# Altium schematic sheet AMX30.SchDoc
size A3
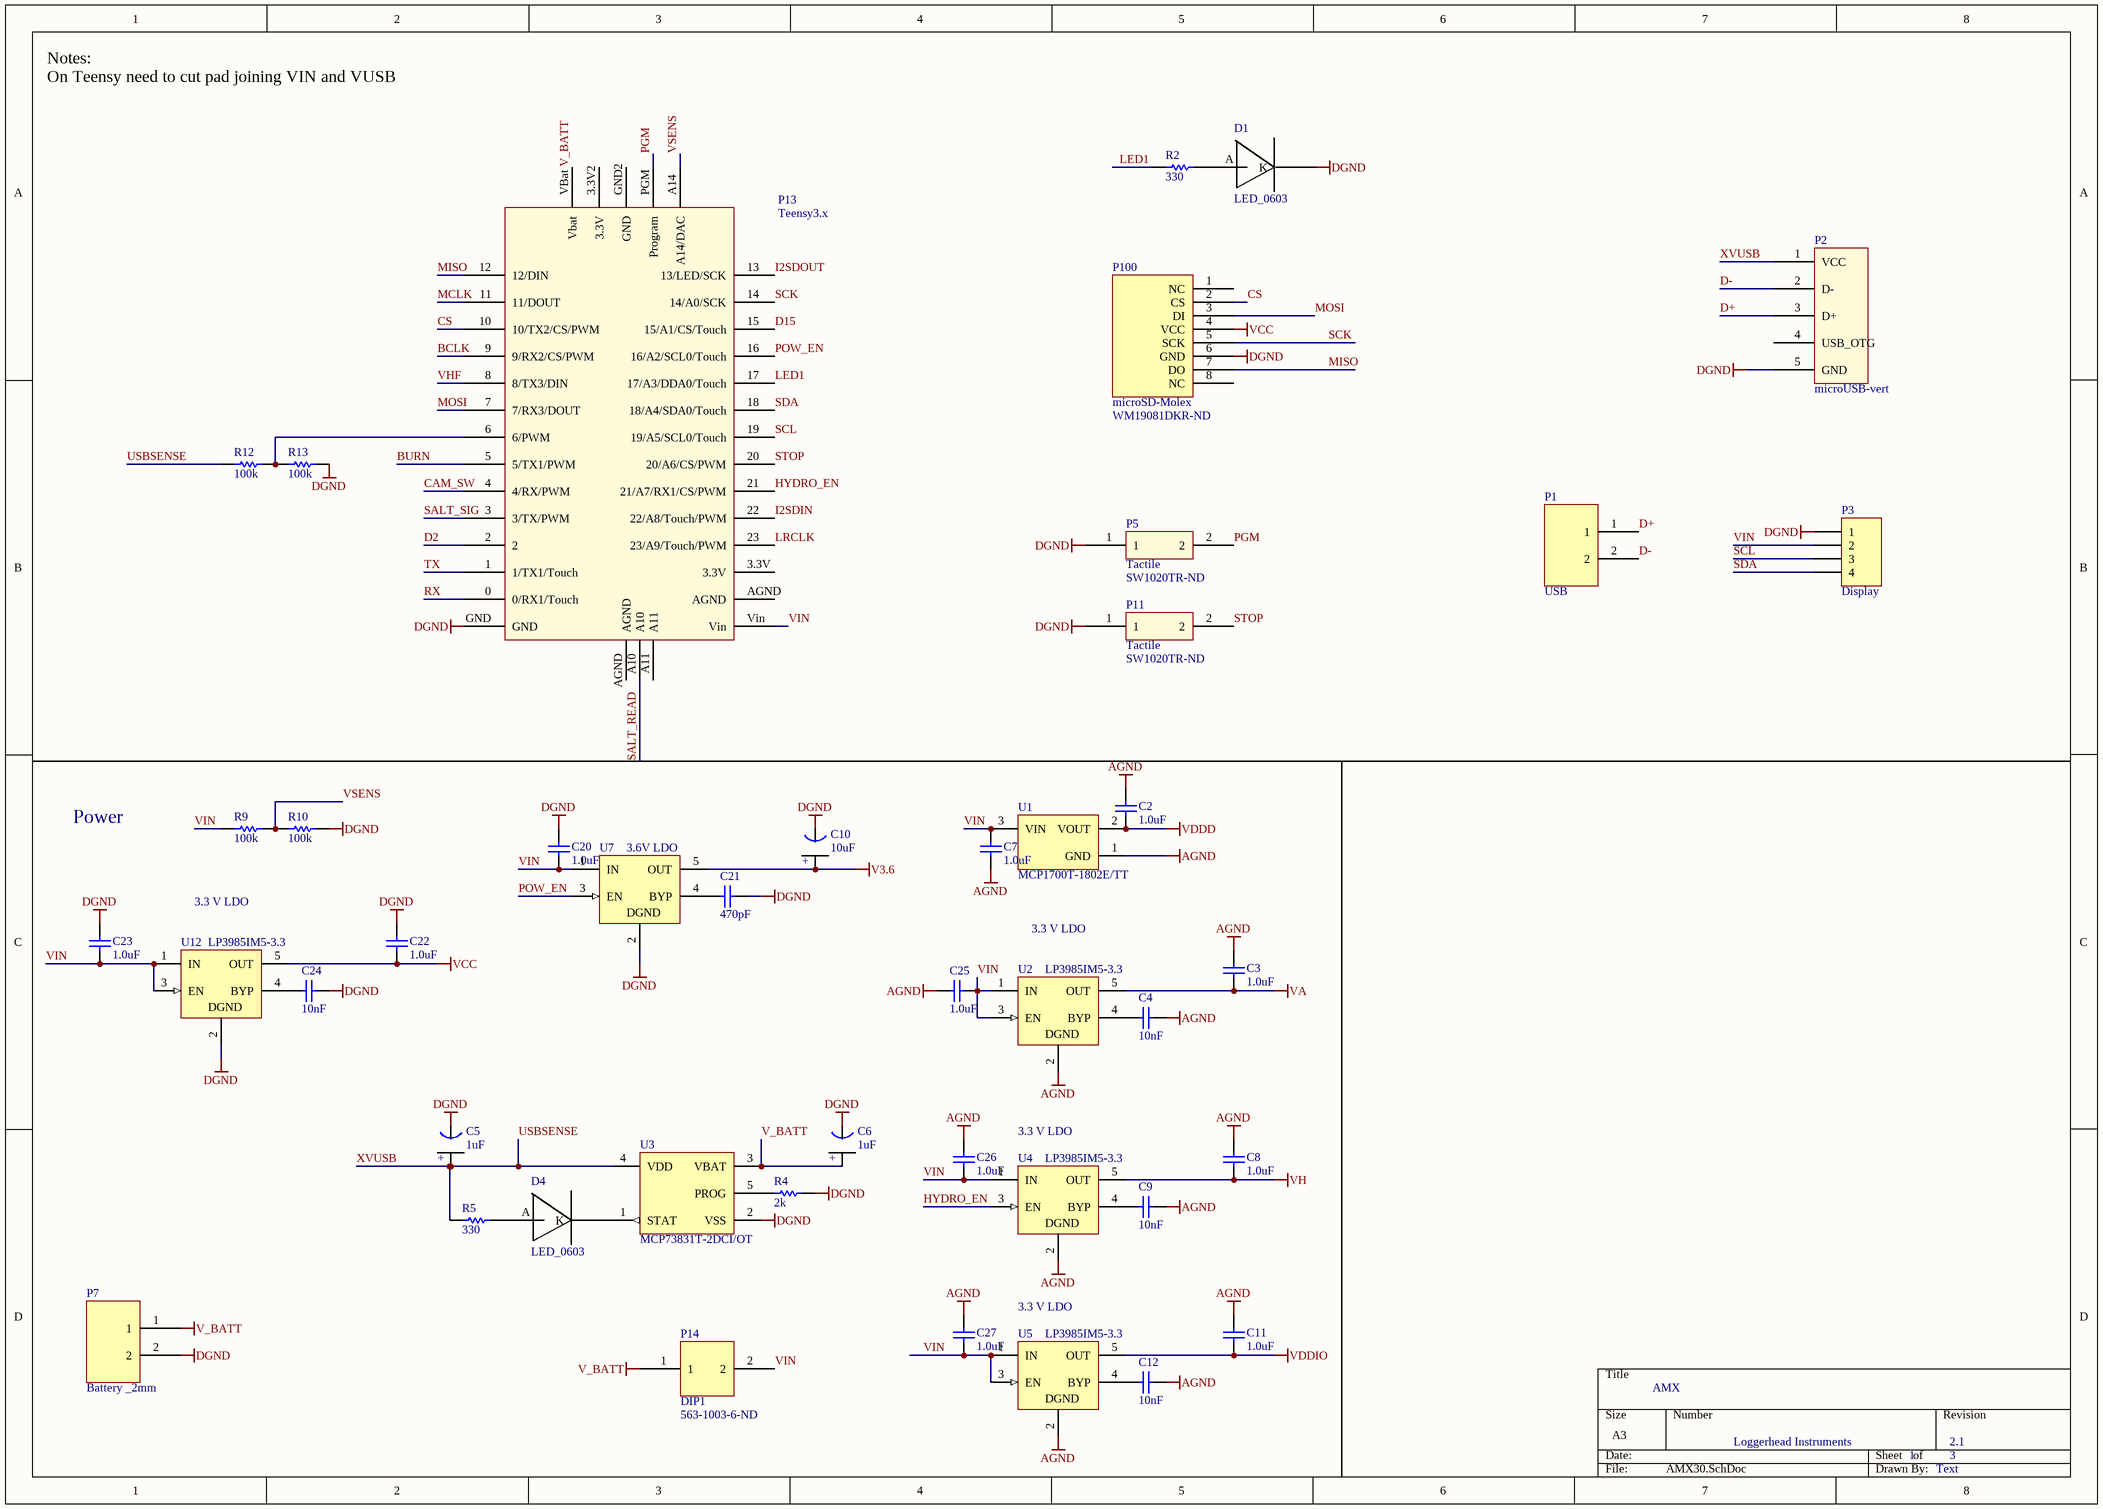
[diagram p0: AMX30.SchDoc]

## Parts
C2  1.0uF  [0402]
C3  1.0uF  [0402]
C4  10nF  [0402]
C5  1uF  [Tant0805]
C6  1uF  [Tant0805]
C7  1.0uF  [0402]
C8  1.0uF  [0402]
C9  10nF  [0402]
C10  10uF  [Tant0805]
C11  1.0uF  [0402]
C12  10nF  [0402]
C20  1.0uF  [0402]
C21  470pF  [0402]
C22  1.0uF  [0402]
C23  1.0uF  [0402]
C24  10nF  [0402]
C25  1.0uF  [0402]
C26  1.0uF  [0402]
C27  1.0uF  [0402]
D1  LED_0603  [Diode0603]
D4  LED_0603  [Diode0603]
P1  USB  [HDR_2x1_2mm]
P2  microUSB-vert  [MICROUSB-VERT]
P3  Display  [HDR1X4]
P5  Tactile  Supplier Part Number 1: SW1020TR-ND  [Tactile-B3U-1000]
P7  Battery _2mm  [HDR_2x1_2mm]
P11  Tactile  Supplier Part Number 1: SW1020TR-ND  [Tactile-B3U-1000]
P13  Teensy3.x  [Teensy3.x]
P14  DIP1  Supplier Part Number 1: 563-1003-6-ND  [DIP1]
P100  microSD-Molex  Supplier Part Number 1: WM19081DKR-ND  [microSD_Molex_hinged]
R2  330  [3-0603]
R4  2k  [3-0603]
R5  330  [3-0603]
R9  100k  [3-0603]
R10  100k  [3-0603]
R12  100k  [3-0603]
R13  100k  [3-0603]
U1  MCP1700T-1802E/TT  [SOT-23-TT3_N]
U2  LP3985IM5-3.3  [MF05A_N]
U3  MCP73831T-2DCI/OT  [SOT-23-OT5_N]
U4  LP3985IM5-3.3  [MF05A_N]
U5  LP3985IM5-3.3  [MF05A_N]
U7  3.6V LDO  [MF05A_N]
U12  LP3985IM5-3.3  [MF05A_N]

## Nets
AGND: C2.2 C3.2 C4.1 C7.2 C8.2 C9.1 C11.2 C12.1 C25.2 C26.2 C27.2 U1.1(GND) U2.2(GND) U4.2(GND) U5.2(GND)
DGND: C5.1(GND) C6.1(GND) C10.1(GND) C20.2 C21.1 C22.2 C23.2 C24.1 D1.K P2.5(GND) P3.1 P5.1 P7.2 P11.1 P13.GND P100.6(GND) R4.1 R10.1 R13.2 U3.2(VSS) U7.2(GND) U12.2(GND)
V3.6: C10.2(+) U7.5(OUT)
V_BATT: C6.2(+) P7.1 P13.VBat(Vbat) P14.1 U3.3(VBAT)
VA: C3.1 U2.5(OUT)
VCC: C22.1 P100.4(VCC) U12.5(OUT)
VDDD: C2.1 U1.2(VOUT)
VDDIO: C11.1 U5.5(OUT)
VH: C8.1 U4.5(OUT)
BCLK: P13.9(9/RX2/CS/PWM)
BURN: P13.5(5/TX1/PWM)
CAM_SW: P13.4(4/RX/PWM)
CS: P13.10(10/TX2/CS/PWM) P100.2(CS)
D2: P13.2
D15: P13.15(15/A1/CS/Touch)
D+: P1.1 P2.3(D+)
D-: P1.2 P2.2(D-)
HYDRO_EN: P13.21(21/A7/RX1/CS/PWM) U4.3(EN)
I2SDIN: P13.22(22/A8/Touch/PWM)
I2SDOUT: P13.13(13/LED/SCK)
LED1: P13.17(17/A3/DDA0/Touch) R2.1
LRCLK: P13.23(23/A9/Touch/PWM)
MCLK: P13.11(11/DOUT)
MISO: P13.12(12/DIN) P100.7(DO)
MOSI: P13.7(7/RX3/DOUT) P100.3(DI)
PGM: P5.2 P13.PGM(Program)
POW_EN: P13.16(16/A2/SCL0/Touch) U7.3(EN)
RX: P13.0(0/RX1/Touch)
SALT_READ: P13.A10
SALT_SIG: P13.3(3/TX/PWM)
SCK: P13.14(14/A0/SCK) P100.5(SCK)
SCL: P3.3 P13.19(19/A5/SCL0/Touch)
SDA: P3.4 P13.18(18/A4/SDA0/Touch)
STOP: P11.2 P13.20(20/A6/CS/PWM)
TX: P13.1(1/TX1/Touch)
USBSENSE: C5.2(+) P2.1(VCC) R5.1 R12.1 U3.4(VDD)  [also labelled XVUSB]
VHF: P13.8(8/TX3/DIN)
VIN: C7.1 C20.1 C23.1 C25.1 C26.1 C27.1 P3.2 P13.Vin P14.2 R9.2 U1.3(VIN) U2.1(IN) U2.3(EN) U4.1(IN) U5.1(IN) U5.3(EN) U7.1(IN) U12.1(IN) U12.3(EN)
VSENS: P13.A14(A14/DAC) R9.1 R10.2
NetC4_2: C4.2 U2.4(BYP)
NetC9_2: C9.2 U4.4(BYP)
NetC12_2: C12.2 U5.4(BYP)
NetC21_2: C21.2 U7.4(BYP)
NetC24_2: C24.2 U12.4(BYP)
NetD1_A: D1.A R2.2
NetD4_A: D4.A R5.2
NetD4_K: D4.K U3.1(STAT)
NetP13_6: P13.6(6/PWM) R12.2 R13.1
NetR4_2: R4.2 U3.5(PROG)

Not connected (* = marked no-connect by the designer): P2 4(USB_OTG); P13 3.3V 3.3V2(3.3V) A11 AGND GND2(GND); P100 1(NC) 8(NC)

## Notes on the sheet
- Notes:
  On Teensy need to cut pad joining VIN and VUSB
- Power
- 3.3 V LDO
- AMX
- Loggerhead Instruments
- 1
- 2.1
- 3
- Text
- (in symbol LP3985IM5-3.3) DGND

## Library data of the parts
C2-C4 C7-C9 C11 C12 C20-C27 = C0402: Ceramic Chip Capacitor - Standard; Note: Footprint corresponds to dimensions for bulk cassette packaging. This case size has tightened tolerances.; Value: 0.1uF; Published: 17-Jul-2002; LatestRevisionDate: 19-Mar-2004; LatestRevisionNote: Silkscreen size reduced.; DatasheetDocument: Mar-2001; PackageDocument: Mar-2001; PackageReference: 0402; Publisher: Altium Limited; Code_JEITA: 0402; Code_IPC: 1005 [0402]; ComponentLink1Description: Manufacturer Link; ComponentLink1URL: http://www.kemet.com/; ComponentLink2Description: Datasheet; ComponentLink2URL: http://www.kemet.com/kemet/web/homepage/kechome.nsf/vapubfilesname/F3102TA.pdf/$file/F3102TA.pdf
C5 C6 = Tant0805: Value: 1uF
C10 = Tant0805: Value: 1uF
P1 P7 = HDR_2x1_2mm: Charging Connector
P2 = microUSB-vert: Molex 105133-0011
P3 = Header 4: Header, 4-Pin; LatestRevisionDate: 17-Jul-2002; LatestRevisionNote: Re-released for DXP Platform.; Publisher: Altium Limited
P5 P11 = Tactile_B3U-1000: Supplier 1: Digi-Key
P100 = microSD_Molex_hinged: Supplier 1: Digi-Key
R2 R4 R5 R9 R10 R12 R13 = ERJ3RK: Precision Thick Film Chip Resistor, 10 Ohm to 1M Ohm Range, 1% and 0.5% Tolerance, 0603 Size, 0.063 W; Published: 17-Dec-2003; LatestRevisionDate: 19-Mar-2004; LatestRevisionNote: Silkscreen size reduced.; PackageDocument: Mar-2003; PackageReference: 3-0603; Publisher: Altium Limited; Code_IPC: 1608 [0603]; ComponentLink1Description: Manufacturer Link; ComponentLink1URL: http://www.panasonic.com/industrial/components/resistive_products.htm; ComponentLink2Description: Datasheet; ComponentLink2URL: http://www.panasonic.com/industrial/components/pdf/AOA0000CE2.pdf
U1 = MCP1700T-1802E/TT: Low Quiescent Current LDO, 3-Pin SOT-23, Extended Temperature, Tape and Reel; Manufacturer: Microchip; DatasheetVersion: revB, Feb-2007; PackageVersion: revBB, Aug-2009; PackageReference: SOT-23-TT3; PackageDescription: 3-Lead Plastic Small Outline Transistor (TT) [SOT-23]; Supplier 1: Digi-Key; Supplier Part Number 1: MCP1700T1802ETTTR-ND; Supplier 2: Digi-Key; Supplier Part Number 2: MCP1700T1802ETTCT-ND; Supplier 3: Digi-Key; Supplier Part Number 3: MCP1700T1802ETTDKR-ND; Supplier 4: Farnell; Supplier Part Number 4: 1296591RL; Supplier 5: Farnell; Supplier Part Number 5: 1296591; Supplier 6: Newark; Supplier Part Number 6: 84R5175; Supplier 7: Mouser; Supplier Part Number 7: 579-MCP1700T1802E/TT; Mounting Technology: Surface Mount; Code_IPC: SOT23-3; PartNumber: MCP1700T-1802E/TT; ComponentLink1Description: Manufacturer URL; ComponentLink1URL: http://www.microchip.com/; ComponentLink2Description: Datasheet; ComponentLink2URL: http://ww1.microchip.com/downloads/en/DeviceDoc/21826b.pdf; ComponentLink3Description: Package Specification; ComponentLink3URL: http://www.microchip.com/stellent/groups/techpub_sg/documents/packagingspec/en012702.pdf
U2 U4 U5 U7 U12 = LP3985IM5-3.3: Micropower, 150mA Low-Noise Ultra Low-Dropout CMOS Voltage Regulator; Manufacturer: National Semiconductor; CompType: LDO IC; PackageTopMarking: LDQB*XTT; PowerWise: N; Published: 4-Dec-2008; DatasheetVersion: Aug-2005; PackageVersion: revD, Aug-2008; PackageReference: MF05A; Publisher: Altium Limited; PackageDescription: Molded SOT-23, .115 x .063 x .040 in Body, 5 Lead, .0375 in Pitch; PartNumber: LP3985IM5-3.3; RoHS: O; PinCount: 5; DigiKeyPartNumber: LP3985IM5-3.3CT-ND; ComponentLink1Description: LP3985 Datasheet; ComponentLink1URL: http://www.national.com/ds/LP/LP3985.pdf; ComponentLink2Description: LP3985 Web Page; ComponentLink2URL: http://www.national.com/pf/LP/LP3985.html; ComponentLink3Description: MF05A Package Page; ComponentLink3URL: http://www.national.com/packaging/folders/mf05a.html
U3 = MCP73831T-2DCI/OT: Miniature Single-Cell, Fully Integrated Li-Ion, Li-Polymer Charge Management Controller, 4.2V, 5-Pin SOT-23, Industrial Temperature, Tape and Reel; DatasheetVersion: revE, Sep-2008; PackageVersion: revBB, Aug-2009; PackageReference: SOT-23-OT5; PackageDescription: 5-Lead Plastic Small Outline Transistor (OT) [SOT-23]; Code_IPC: SOT23-5; ComponentLink1Description: Manufacturer URL; ComponentLink1URL: http://www.microchip.com/; ComponentLink2Description: Datasheet; ComponentLink2URL: http://ww1.microchip.com/downloads/en/DeviceDoc/21984e.pdf; ComponentLink3Description: Package Specification; ComponentLink3URL: http://www.microchip.com/stellent/groups/techpub_sg/documents/packagingspec/en012702.pdf
P14 = DIP1: Supplier 1: Digi-Key